# Altium schematic sheet Wi-Fi.SchDoc: WiFi & Extension
size A4; Organization: Use Organization_Name in ProjParam; Address1: EFI & DBR; Address2: STI-IMT-LSRO1; Address3: EPFL; Address4: CH-1015 LAUSANNE; DocumentNumber: 5; Revision: A; SheetNumber: 5; SheetTotal: 2; ApprovedBy: Init ApprovedBy in DocParam; CheckedBy: Init CheckedBy in DocParam; Author: Init Author in DocParam; CompanyName: Init CompanyName in DocParam; DrawnBy: Init DrawBy in DocParam; Engineer: Init Engineer in DocParam; DocumentName: Init DocumentName in DocParam; ProjectName: Init ProjectName in DocParam
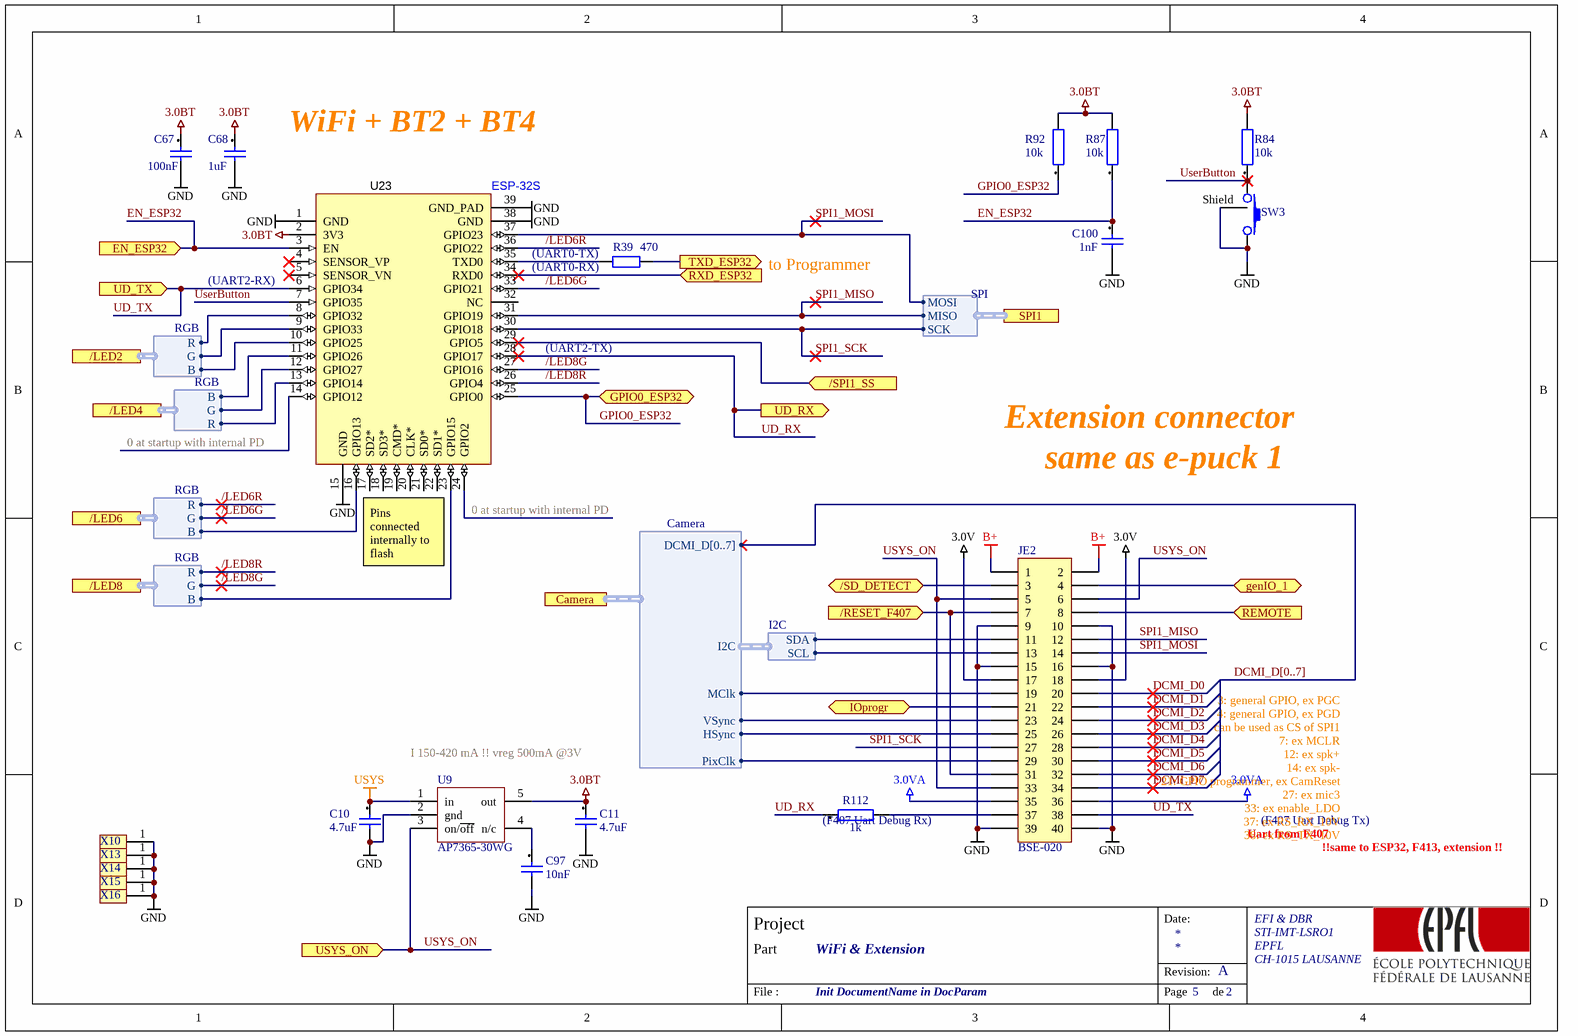
[diagram p0: Wi-Fi.SchDoc]

## Parts
C10  4.7uF  [ROB_0603]
C11  4.7uF  [ROB_0603]
C67  100nF  [ROB_0603]
C68  1uF  [ROB_0603]
C97  10nF  [ROB_0603]
C100  1nF  [ROB_0603]
JE2  BSE-020  [BSE-020]
R39  470  [ROB_0603]
R84  10k  [ROB_0603]
R87  10k  [ROB_0603]
R92  10k  [ROB_0603]
R112  1k  [ROB_0603]
SW3  button  [C&K_KMR2]  (value not drawn)
U9  value AP7365-30WG  [Sot23-5]  (hidden comment: LDO 3V0 600mA)
U23  ESP-32S  [ESP-32S]
X10  STE-1  [HEADER1x1]  (value not drawn)
X13  STE-1  [HEADER1x1]  (value not drawn)
X14  STE-1  [HEADER1x1]  (value not drawn)
X15  STE-1  [HEADER1x1]  (value not drawn)
X16  STE-1  [HEADER1x1]  (value not drawn)

## Ports
/LED2 (harness RGB), /LED4 (harness RGB), /LED6 (harness RGB), /LED8 (harness RGB), /RESET_F407 (in), /SD_DETECT (bidir), /SPI1_SS (in), Camera (harness Camera), EN_ESP32 (in), genIO_1 (bidir), GPIO0_ESP32 (bidir), IOprogr (bidir), REMOTE (in), RXD_ESP32 (in), SPI1 (harness SPI), TXD_ESP32 (out), UD_RX (out), UD_TX (in), USYS_ON (in)

## Harnesses
Camera: DCMI_D[0..7], HSync, VSync, MClk, PixClk, I2C
I2C: SDA, SCL
RGB: R, G, B
SPI: SCK, MOSI, MISO

## Nets
3.0BT: C11.1 C67.1 C68.1 R84.2 R87.2 R92.2 U9.5(out) U23.2(3V3)
3.0V: JE2.17 JE2.18
3.0VA: JE2.35 JE2.36
B+: JE2.1 JE2.2
GND: C10.2 C11.2 C67.2 C68.2 C97.2 C100.2 JE2.9 JE2.10 JE2.15 JE2.16 JE2.39 JE2.40 SW3.1 SW3.Shield U9.2(gnd) U23.1(GND) U23.15(GND) U23.38(GND) U23.39(GND_PAD) X10.1 X13.1 X14.1 X15.1 X16.1
USYS: C10.1 U9.1(in)
/LED6G: U23.33(GPIO21) ; port /LED6.G
/LED6R: U23.36(GPIO22) ; port /LED6.R
/LED8G: U23.27(GPIO16) ; port /LED8.G
/LED8R: U23.26(GPIO4) ; port /LED8.R
/RESET_F407: JE2.7 JE2.31 ; port /RESET_F407
/SD_DETECT: JE2.3 ; port /SD_DETECT
/SPI1_SS: U23.29(GPIO5) ; port /SPI1_SS
DCMI_D0: JE2.20
DCMI_D1: JE2.22
DCMI_D2: JE2.24
DCMI_D3: JE2.26
DCMI_D4: JE2.28
DCMI_D5: JE2.30
DCMI_D6: JE2.32
DCMI_D7: JE2.34
EN_ESP32: C100.1 R87.1 U23.3(EN) ; port EN_ESP32
genIO_1: JE2.4 ; port genIO_1
GPIO0_ESP32: R92.1 U23.25(GPIO0) ; port GPIO0_ESP32
IOprogr: JE2.21 ; port IOprogr
REMOTE: JE2.8 ; port REMOTE
RXD_ESP32: U23.34(RXD0) ; port RXD_ESP32
SPI1_MISO: JE2.12 U23.31(GPIO19) ; port SPI1.MISO
SPI1_MOSI: JE2.14 U23.37(GPIO23) ; port SPI1.MOSI
SPI1_SCK: JE2.27 U23.30(GPIO18) ; port SPI1.SCK
TXD_ESP32: R39.2 ; port TXD_ESP32
UD_RX: R112.1 U23.28(GPIO17) ; port UD_RX
UD_TX: JE2.38 U23.6(GPIO34) ; port UD_TX
UserButton: R84.1 SW3.2 U23.7(GPIO35)
USYS_ON: JE2.5 JE2.6 JE2.33 U9.3(on/~{off}) ; port USYS_ON
NetC97_1: C97.1 U9.4(n/c)
NetJE2_11: JE2.11 ; harness I2C.SDA
NetJE2_13: JE2.13 ; harness I2C.SCL
NetJE2_19: JE2.19 ; port Camera.MClk
NetJE2_23: JE2.23 ; port Camera.VSync
NetJE2_25: JE2.25 ; port Camera.HSync
NetJE2_29: JE2.29 ; port Camera.PixClk
NetJE2_37: JE2.37 R112.2
NetR39_1: R39.1 U23.35(TXD0)
NetU23_8: U23.8(GPIO32) ; port /LED2.R
NetU23_9: U23.9(GPIO33) ; port /LED2.G
NetU23_10: U23.10(GPIO25) ; port /LED2.B
NetU23_11: U23.11(GPIO26) ; port /LED4.B
NetU23_12: U23.12(GPIO27) ; port /LED4.G
NetU23_13: U23.13(GPIO14) ; port /LED4.R
NetU23_16: U23.16(GPIO13) ; port /LED6.B
NetU23_23: U23.23(GPIO15) ; port /LED8.B

Not connected (* = marked no-connect by the designer): U23 4(SENSOR_VP)* 5(SENSOR_VN)* 14(GPIO12) 17(SD2*) 18(SD3*) 19(CMD*) 20(CLK*) 21(SD0*) 22(SD1*) 24(GPIO2) 32(NC)

## Buses and harness runs
bus DCMI_D[0..7]

## Notes on the sheet
- WiFi + BT2 + BT4
- (near U23) (UART2-RX)
- (near R39) (UART0-TX)
- (near R39) (UART0-RX)
- to Programmer
- (UART2-TX)
- (near U23) 0 at startup with internal PD
- Extension connector
- same as e-puck 1
- (near U23) Pins connected internally to flash
- 3: general GPIO, ex PGC
- 4: general GPIO, ex PGD
- I 150-420 mA !! vreg 500mA @3V
- 27: ex mic3
- 14: ex spk-
- 12: ex spk+
- 21: GPIO programmer, ex CamReset
- can be used as CS of SPI1
- 7: ex MCLR
- (near R112) (F407 Uart Debug Rx)
- Uart from F407
- (F407 Uart Debug Tx)
- (near JE2) !!same to ESP32, F413, extension !!
- 38: ex RS_TX_10V
- 37: ex RS_RX_10V
- 33: ex enable_LDO
- Date:
- Project
- Part
- Revision:
- File :
- Page
- de

## Library data of the parts
C10 C11 C67 C68 C97 C100 = 1uF[[/\]]0603[[/\]]2: Capacitor; Manufacturer: Kemet; Manufacturer Nr: C0603C105K3PAC; Preference: 2; Tolerance +: +10; Tolerance -: -10; Dielectric: X7R; Voltage: 25; MaxTemperature: +125; MinTemperature: -55; Quant_1: 10; Quant_2: 100; Quant_3: 1000; Quant_4: 4000; Currentie: CHF; Size: 0603; Footprint Acort: 0603_G; Supplier: Farnell; Supplier Nr: 1288202; ComponentLink2Description: Farnell link; ComponentLink2URL: http://ch.farnell.com/jsp/displayProduct.jsp?sku=1288202; Price_1: 0,235; Price_2: 0,151; Price_3: 0,12; Price_4: 0,088; ROHS: True; DateLastUpdate: 2007-12-03 / 14:22:47
  C10 C11: Value: 4.7uF
  C67: Value: 100nF
  C68: Value: 1uF
  C97: Value: 10nF
  C100: Value: 1nF
JE2 = BSE-020: Samtec BSE-020; Manufacturer: Generic Components; Class I: Connector; Revision: July-2002: Re-released for DXP Platform.; Publisher: Altium Limited
R39 = Res2: Resistor; Published: 8-Jun-2000; LatestRevisionDate: 17-Jul-2002; LatestRevisionNote: Re-released for DXP Platform.; PackageReference: AXIAL-0.4; Publisher: Altium Limited; Value: 470
R84 R87 R92 R112 = 10K[[/\]]0603[[/\]]2: Resistor; Manufacturer: Multicomp; Manufacturer Nr: MC 0.063W 0603 1% 10K; Tolerance: +/-1; Preference: 2; Power: 0.063; Voltage: 50; Current: 1; ppm/K: +/-100; Quant_2: 250; Quant_3: 1000; Quant_4: 5000; Quant_5: 15000; Currentie: CHF; Size: 0603; Footprint Acort: 0603; ComponentLink1Description: OnLine datasheet; Supplier: Farnell; Supplier Nr: 9330399; ComponentLink2Description: Farnell link; ComponentLink2URL: http://ch.farnell.com/jsp/displayProduct.jsp?sku=9330399; ROHS: True; Quant_1: 50; Price_1: 0,062; Price_2: 0,049; Price_3: 0,038; Price_4: 0,027; Price_5: 0,021; DateLastUpdate: 2007-11-29 / 09:14:40
  R84 R87 R92: Value: 10k
  R112: Value: 1k
SW3 = MM6FVS[[/\]]1: KMR221GLFS; Manufacturer: Tyco; Manufacturer Nr: 7-188275-6; Preference: 1; Currentie: CHF; Quant_1: 10; Quant_2: 900; Circuit: SPST-NO; Switch Function: Off-Mom; Contact Rating @ Voltage: 0.05A @ 32VDC; Actuator Type: Standard; Actuator Height off PCB, from Pins: 1.90mm; Actuator Orientation: Top Actuated; Outline: 4.60mm x 2.80mm; Illumination: Non-Illuminated; Operating Force: 200gf; Switch Travel: 0.25mm; Mechanical Life: 200,000 Cycles; Footprint Acort: ToDefine; ComponentLink1Description: Datasheet; ComponentLink1URL: http://ecommas.tycoelectronics.com/commerce/DocumentDelivery/DDEController?Action=showdoc&DocId=Customer+Drawing%7F188275%7FR%7Fpdf%7FEnglish%7FC_188275_R.pdf; Supplier: Farnell; Supplier Nr: 1056234; ComponentLink2Description: Farnell link; ComponentLink2URL: http://fr.farnell.com/jsp/displayProduct.jsp?sku=1056234; ROHS: True; Type: SMD; Orientation: Vertical; DateLastUpdate: 2007-12-04 / 09:15:57; Price_1: 1,1; Price_2: 0,924; Supplier 1: Digi-Key; Manufacturer Part Number: KMR221GLFS; Category: Switches; Stock 1: 20549; Pricing 1: 1=0.51, 10=0.493, 25=0.484, 50=0.4656, 100=0.4017, 250=0.3652, 500=0.34694, 1000=0.2739 (USD); Packaging: Cut Tape (CT); Mounting Type: Surface Mount; Termination Style: Gull Wing; Illumination Voltage (Nominal): -; Illumination Type, Color: -; Ingress Protection: -; Features: Grounding Pin; Actuator Material: -; Operating Temperature: -40°C ~ 85°C; ComponentLink3URL: http://www.ck-components.com/index.php?module=media&action=Display&cmpref=14414&lang=en&width=&height=&format=&alt=; ComponentLink3Description: http://www.ck-components.com/index.php?module=media&action=Display&cmpref=14414&lang=en&width=&height=&format=&alt=; Supplier Part Number 1: 401-1427-1-ND
U9 = LP2981
U23 = ESP-32S: Wi-Fi BT BLE MCU Module; MANUFACTURER: TEXAS INSTRUMENTS; POPULATE: Y; CONSIGNED: Y; VALUE: ESP-32S